# Altium schematic sheet 1XGSH00_IMU.SchDoc
size A4
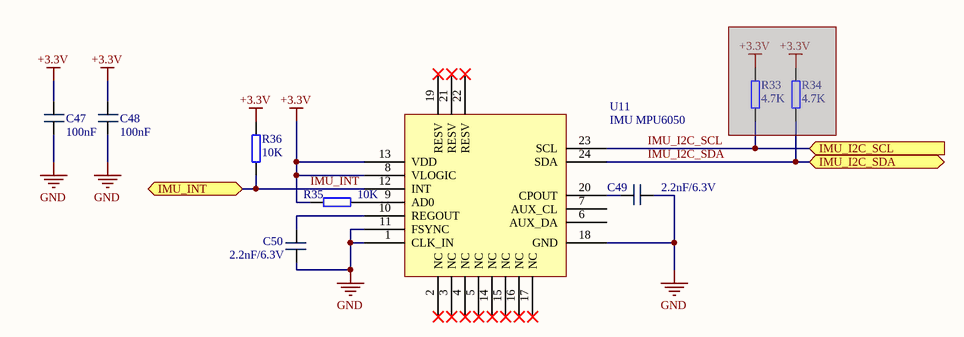
[diagram p0: 1XGSH00_IMU.SchDoc]

## Parts
C47  100nF  [0402_C]
C48  100nF  [0402_C]
C49  2.2nF/6.3V  [0402_C]
C50  2.2nF/6.3V  [0402_C]
R33  4.7K  [0402_R]  (masked out: inside a compile mask, not in the netlist)
R34  4.7K  [0402_R]  (masked out: inside a compile mask, not in the netlist)
R35  10K  [0402_R]
R36  10K  [0402_R]
U11  IMU MPU6050  [QFN-24_4x4x05P]

## Ports
IMU_I2C_SCL (in), IMU_I2C_SDA (bidir), IMU_INT (bidir)

## Nets
+3.3V: C47.2(-) C48.2(-) R35.1 R36.2 U11.8(VLOGIC) U11.13(VDD)
GND: C47.1(-) C48.1(-) C49.1(-) C50.2(-) U11.1(CLK_IN) U11.11(FSYNC) U11.18(GND)
IMU_I2C_SCL: U11.23(SCL) ; port IMU_I2C_SCL
IMU_I2C_SDA: U11.24(SDA) ; port IMU_I2C_SDA
IMU_INT: R36.1 U11.12(INT) ; port IMU_INT
NetC49_2: C49.2(-) U11.20(CPOUT)
NetC50_1: C50.1(-) U11.10(REGOUT)
NetR35_2: R35.2 U11.9(AD0)

Not connected (* = marked no-connect by the designer): U11 2(NC)* 3(NC)* 4(NC)* 5(NC)* 6(AUX_DA) 7(AUX_CL) 14(NC)* 15(NC)* 16(NC)* 17(NC)* 19(RESV)* 21(RESV)* 22(RESV)*

## Library data of the parts
C47-C50 = Capacitor
R33-R36 = Resistor: Value: 1K
U11 = MPU6050: GyroScope (IMU)